# Altium schematic sheet Fri3D_2024_Peripherals.SchDoc: Peripherals
size A3; Date: 20/03/2024; DrawnBy: Wim Van Gool; DocumentNumber: 3; Revision: 01; SheetNumber: 3; SheetTotal: 4
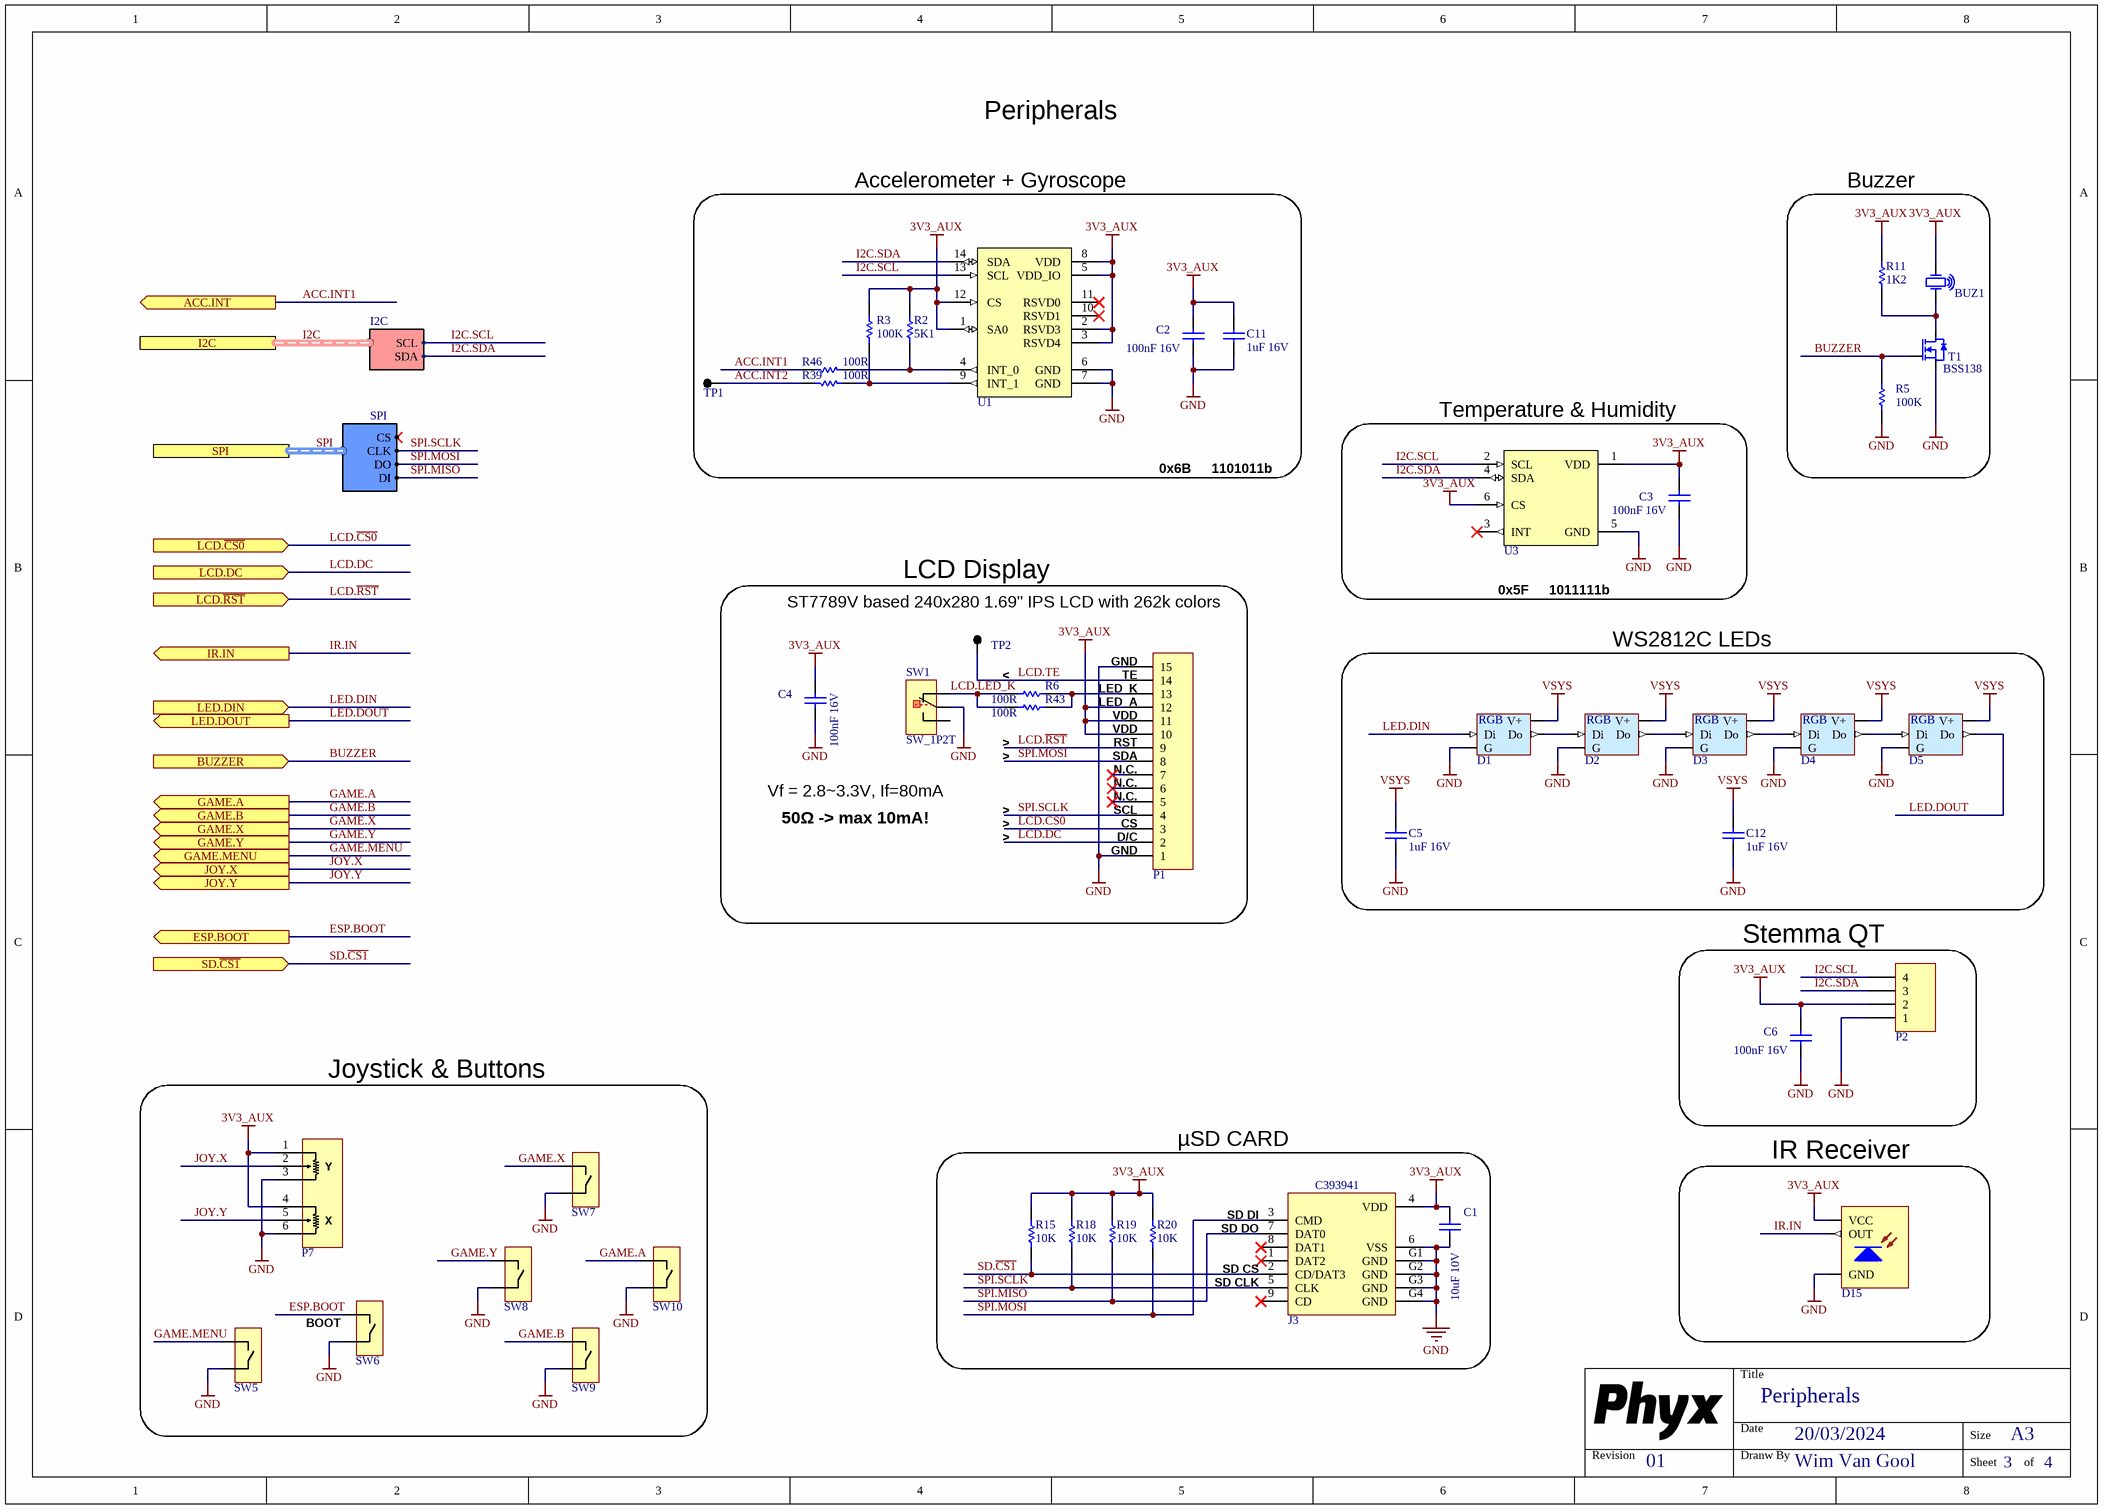
[diagram p0: Fri3D_2024_Peripherals.SchDoc]

## Parts
BUZ1  12x12x3mm Piezo Buzzer Transducer 81dB  [CUI_CMT-1203-SMT]  (value not drawn)
C1  value 10uF 10V  [C0805_N]  (hidden comment: CAP_CERAMIC)
C2  value 100nF 16V  [C0603_N]
C3  value 100nF 16V  [C0603_N]
C4  value 100nF 16V  [C0603_N]
C5  value 1uF 16V  [C0603_N]  (hidden comment: CAP_CERAMIC)
C6  value 100nF 16V  [C0603_N]
C11  value 1uF 16V  [C0603_N]  (hidden comment: CAP_CERAMIC)
C12  value 1uF 16V  [C0603_N]  (hidden comment: CAP_CERAMIC)
D1  WS2812 based digital RGB LED 5050 White package reduced current  [LED_5050_WS2812B_WHITE]  (value not drawn)
D2  WS2812 based digital RGB LED 5050 White package reduced current  [LED_5050_WS2812B_WHITE]  (value not drawn)
D3  WS2812 based digital RGB LED 5050 White package reduced current  [LED_5050_WS2812B_WHITE]  (value not drawn)
D4  WS2812 based digital RGB LED 5050 White package reduced current  [LED_5050_WS2812B_WHITE]  (value not drawn)
D5  WS2812 based digital RGB LED 5050 White package reduced current  [LED_5050_WS2812B_WHITE]  (value not drawn)
D15  ZIRM-5042B-42-Z2 Infrared Receiver 38 kHz 45° 2.7-5.5V 940nm  [CHAU_ZIRM-5042B-42-Z2]  (value not drawn)
J3  Supplier Part Number 1: C393941  [TFP09-2-12B]  (hidden comment: Micro SD PiPo Push-Push)
P1  Top contact FPC 0.3mm pitch 15 contacts  [FPC_0.3K-HX-15PWB]  (value not drawn)
P2  Header 1.0mm RA Shrouded 4  [WE_665104131822]  (value not drawn)
P7  PSP Mini Joystick  [PSP_Mini_Joystick]  (value not drawn)
R2  value 5K1  [R0603_N]  (hidden comment: RESISTOR)
R3  value 100K  [R0603_N]  (hidden comment: RESISTOR)
R5  value 100K  [R0603_N]  (hidden comment: RESISTOR)
R6  value 100R  [R0603_N]  (hidden comment: RESISTOR)
R11  value 1K2  [R0603_N]  (hidden comment: RESISTOR)
R15  value 10K  [R0603_N]  (hidden comment: RESISTOR)
R18  value 10K  [R0603_N]  (hidden comment: RESISTOR)
R19  value 10K  [R0603_N]  (hidden comment: RESISTOR)
R20  value 10K  [R0603_N]  (hidden comment: RESISTOR)
R39  value 100R  [R0603_N]  (hidden comment: RESISTOR)
R43  value 100R  [R0603_N]  (hidden comment: RESISTOR)
R46  value 100R  [R0603_N]  (hidden comment: RESISTOR)
SW1  SW_1P2T  [WE_450404015514]
SW5  SKPMAME010 6x6 TACTG Switch  [ALPS_SKPMAME010]  (value not drawn)
SW6  SKPMAME010 6x6 TACTG Switch  [ALPS_SKPMAME010]  (value not drawn)
SW7  SKPMAME010 6x6 TACTG Switch  [ALPS_SKPMAME010]  (value not drawn)
SW8  SKPMAME010 6x6 TACTG Switch  [ALPS_SKPMAME010]  (value not drawn)
SW9  SKPMAME010 6x6 TACTG Switch  [ALPS_SKPMAME010]  (value not drawn)
SW10  SKPMAME010 6x6 TACTG Switch  [ALPS_SKPMAME010]  (value not drawn)
T1  value BSS138  [SOT23-3]  (hidden comment: 0.2A N-Ch MOSFET Vgs 3.2)
TP1  TEST_PAD  [TP_1.2mm]  (value not drawn)
TP2  TEST_PAD  [TP_1.2mm]  (value not drawn)
U1  Acceleration ±2, ±4, ±8, ±16g Gyro ±125, ±250, ±500, ±1000, ±2000dps  [WE_2536030320001]  (value not drawn)
U3  WSEN-HIDS 2525020210001 temperature and humidity sensor Digital I2C  [WE_2525020210001]  (value not drawn)

## Blocks framed on the sheet
Accelerometer + Gyroscope: C2 C11 R2 R3 R39 R46 TP1 U1
Buzzer: BUZ1 R5 R11 T1
Temperature & Humidity: C3 U3
LCD Display: C4 P1 R6 R43 SW1 TP2
WS2812C LEDs: C5 C12 D1-D5
Stemma QT: C6 P2
Joystick & Buttons: P7 SW5-SW10
µSD CARD: C1 J3 R15 R18-R20
IR Receiver: D15

## Ports
ACC.INT (out), BUZZER (in), ESP.BOOT (out), GAME.A (out), GAME.B (out), GAME.MENU (out), GAME.X (out), GAME.Y (out), I2C (harness I2C), IR.IN (out), JOY.X (out), JOY.Y (out), LCD.DC (in), LCD.~{CS0} (in), LCD.~{RST} (in), LED.DIN (in), LED.DOUT (out), SD.~{CS1} (in), SPI (harness SPI)

## Harnesses
I2C: SDA, SCL
SPI: CS, CLK, DO, DI

## Nets
3V3_AUX: BUZ1.2(OSC2) C1.1 C2.1 C3.1 C4.1 C6.1 C11.1 D15.3(VCC) J3.4(VDD) P1.10 P1.11 P1.12 P2.2 P7.1 P7.4 R2.1 R3.1 R11.2 R15.1 R18.1 R19.1 R20.1 U1.1(SA0) U1.2(RSVD3) U1.3(RSVD4) U1.5(VDD_IO) U1.8(VDD) U1.12(CS) U3.1(VDD) U3.6(CS)
GND: C1.2 C2.2 C3.2 C4.2 C5.2 C6.2 C11.2 C12.2 D1.3(G) D2.3(G) D3.3(G) D4.3(G) D5.3(G) D15.2(GND) J3.6(VSS) J3.G1(GND) J3.G2(GND) J3.G3(GND) J3.G4(GND) P1.1 P1.15 P2.1 P7.3 P7.6 R5.2 SW1.2 SW5.2 SW6.2 SW7.2 SW8.2 SW9.2 SW10.2 T1.2(S) U1.6(GND) U1.7(GND) U3.5(GND)
VSYS: C5.1 C12.1 D1.1(V+) D2.1(V+) D3.1(V+) D4.1(V+) D5.1(V+)
ACC.INT1: R46.2 ; port ACC.INT
ACC.INT2: R39.2 TP1.1
BUZZER: R5.1 T1.1(G) ; port BUZZER
ESP.BOOT: SW6.1 ; port ESP.BOOT
GAME.A: SW10.1 ; port GAME.A
GAME.B: SW9.1 ; port GAME.B
GAME.MENU: SW5.1 ; port GAME.MENU
GAME.X: SW7.1 ; port GAME.X
GAME.Y: SW8.1 ; port GAME.Y
I2C.SCL: P2.4 U1.13(SCL) U3.2(SCL) ; port I2C.SCL
I2C.SDA: P2.3 U1.14(SDA) U3.4(SDA) ; port I2C.SDA
IR.IN: D15.1(OUT) ; port IR.IN
JOY.X: P7.2 ; port JOY.X
JOY.Y: P7.5 ; port JOY.Y
LCD.~{CS0}: P1.3 ; port LCD.~{CS0}
LCD.DC: P1.2 ; port LCD.DC
LCD.LED_K: R6.2 R43.2 SW1.1
LCD.~{RST}: P1.9 ; port LCD.~{RST}
LCD.TE: P1.14 TP2.1
LED.DIN: D1.4(Di) ; port LED.DIN
LED.DOUT: D5.2(Do) ; port LED.DOUT
SD.~{CS1}: J3.2(CD/DAT3) R15.2 ; port SD.~{CS1}
SPI.MISO: J3.7(DAT0) R19.2 ; port SPI.DI  [project net SPI.DI]
SPI.MOSI: J3.3(CMD) P1.8 R20.2 ; port SPI.DO  [project net SPI.DO]
SPI.SCLK: J3.5(CLK) P1.4 R18.2 ; port SPI.CLK  [project net SPI.CLK]
NetBUZ1_1: BUZ1.1(OSC1) R11.1 T1.3(D)
NetD1_2: D1.2(Do) D2.4(Di)
NetD2_2: D2.2(Do) D3.4(Di)
NetD3_2: D3.2(Do) D4.4(Di)
NetD4_2: D4.2(Do) D5.4(Di)
NetP1_13: P1.13 R6.1 R43.1
NetR2_2: R2.2 R46.1 U1.4(INT_0)
NetR3_2: R3.2 R39.1 U1.9(INT_1)

Not connected (* = marked no-connect by the designer): J3 1(DAT2)* 8(DAT1)* 9(CD)*; P1 5* 6* 7*; SW1 3; U1 10(RSVD1)* 11(RSVD0)*; U3 3(INT)*

## Buses and harness runs
harness I2C = port I2C
harness SPI = port SPI

## Notes on the sheet
- 0x6B
- 1101011b
- (near TP2) ST7789V based 240x280 1.69" IPS LCD with 262k colors
- (near P1) GND
- (near U3) 0x5F
- (near U3) 1011111b
- (near R6) <
- (near P1) VDD
- (near P1) LED_A
- (near P1) LED_K
- (near P1) TE
- >
- (near P1) N.C.
- (near P1) SDA
- (near P1) RST
- Vf = 2.8~3.3V, If=80mA
- 50Ω -> max 10mA!
- (near P1) D/C
- (near P1) CS
- (near P1) SCL
- (near J3) SD DI
- (near J3) SD DO
- (near J3) SD CS
- (near SW6) BOOT
- (near J3) SD CLK
- Title
- Revision
- Date
- Dranw By
- Size
- A3
- Sheet
- of
- (in symbol JOY # PSP Mini Joystick) Y; X
- (in symbol LED # RGB WS2812C-5050 WH) RGB

## Library data of the parts
BUZ1 = BUZ # CUI CMT-1203-SMT: Crystal Oscillator; Value: CMT-1203-SMT; Supplier 1: Digikey; Supplier Part Number 1: 102-2197-1-ND; Supplier 2: Aliexpress; Supplier Part Number 2: KLJ-1230
C1 = CAP # 10uF 10V 0805: Capacitor Ceramic; Supplier 1: Farnell; Supplier Part Number 1: 2320859
C2-C4 C6 = CAP # 100nF 16V 0603: Capacitor Ceramic
C5 C11 C12 = CAP # 1uF 16V 0603: Capacitor Ceramic; Supplier 1: Farnell; Supplier Part Number 1: 2320814
D1-D5 = LED # RGB WS2812C-5050 WH: =Description; Value: WS218C 5050 WH; Supplier 1: Aliexpress; Supplier Part Number 1: WS2812C Black 5050; Supplier 2: LCSC; Supplier Part Number 2: C114587
D15 = PHO # IR Rx 940nm ZIRM-5042B-42-Z2: =Description; Value: ZIRM-5042B-42-Z2; Supplier 1: LCSC; Supplier Part Number 1: C575386
J3 = MicroSD TFP09-2-12B Push-Push: =Description; Value: TFP09-2-12B; Supplier 1: LCSC
P1 = FPC # 15 Top 0.3mm 0.3K-HX-15PWB: Value: 0.3K-HX-15PWB; Supplier 1: LCSC; Supplier Part Number 1: C2919525
P2 = HDR # RA SHR 1.0mm 4way - 665104131822: Value: 665104131822; Supplier 1: Wurth; Supplier Part Number 1: 665104131822; Supplier 2: Mouser; Supplier Part Number 2: 710-665104131822
P7 = JOY # PSP Mini Joystick: Value: PSP Mini Joystick; Supplier 1: AliExpress; Supplier Part Number 1: 32958017132
R2 = RES # 5K1 0603: Supplier 3: Generic; Supplier Part Number 3: 5K1 1% 0603; Supplier 1: Farnell; Supplier Part Number 1: 2845922; Supplier 2: LCSC; Supplier Part Number 2: C112314
R3 R5 = RES # 100K 0603: Supplier 3: Generic; Supplier Part Number 3: 100K 1% 0603
R6 R39 R43 R46 = RES # 100R 0603
R11 = RES # 1K2 0603
R15 R18-R20 = RES # 10K 0603: Supplier 1: Farnell; Supplier Part Number 1: 2502397
SW1 = SW # 1P2T WS-SLSU mini slide 6,7 x 2,7 mm
SW5-SW10 = SW # TACT ALPS SKPMAME010: Value: SKPMAME010; Supplier 1: LCSC; Supplier Part Number 1: C115348; Supplier 2: Farnell; Supplier Part Number 2: 2056804; Supplier 3: Mouser; Supplier Part Number 3: 688-SKPMAM
T1 = BSS138 N-Ch MOSFET 0.2A 3.2Vgs 60Vds: Supplier 1: Farnell; Supplier Part Number 1: 2432717
TP1 TP2 = TP # 1.2mm: Value: NO BOM
U1 = ACCELERO GYRO # WSEN-ISDS: =Description; Value: 2536030320001; Supplier 1: Würth; Supplier Part Number 1: 2536030320001
U3 = TMP HUM # WSEN-HIDS: =Description; Value: 2525020210001; Supplier 1: Digi-key; Supplier Part Number 1: 1917-2525020210001CT-ND; Supplier 2: Farnell; Supplier Part Number 2: 3759082; Supplier 3: Mouser; Supplier Part Number 3: 710-2525020210001